# EAGLE design bengkel_elektronika(penghitung otomatis) (EAGLE 7.1.0)
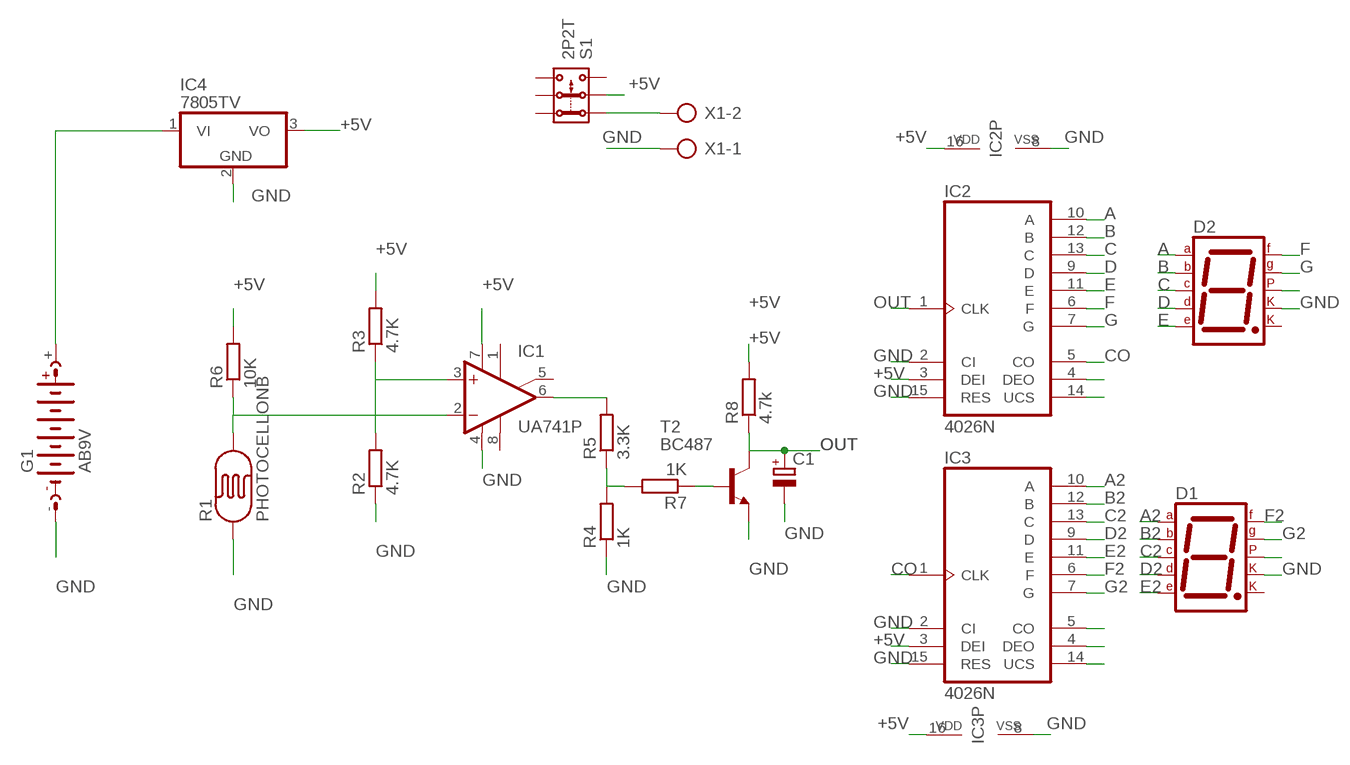
[diagram p0: schematic, sheet 1]

## Parts
C1  CPOL-EUE2-4  [E2-4]
D1  7SEG-CK  [7SEG-13]
D2  7SEG-CK  [7SEG-13]
G1  AB9V  [AB9V]
IC1  UA741P  [DIL08]
IC2  4026N  [DIL16]
IC3  4026N  [DIL16]
IC4  7805TV  [TO220V]
R1  PHOTOCELLONB  [ON_BOARD]
R2  4.7K  R-EU_0207/7  [0207/7]
R3  4.7K  R-EU_0207/7  [0207/7]
R4  1K  R-EU_0207/7  [0207/7]
R5  3.3K  R-EU_0207/7  [0207/7]
R6  10K  R-EU_0207/7  [0207/7]
R7  1K  R-EU_0207/7  [0207/7]
R8  4.7k  R-EU_0207/7  [0207/7]
S1  2P2T  [2P2T]
T2  BC487  [TO92-EBC]
X1  AK500/2  [AK500/2]

## Nets
+5V: IC1.7(V+) IC2.3(DEI) IC2.16(VDD) IC3.3(DEI) IC3.16(VDD) IC4.3(VO) R3.2 R6.2 R8.2 S1.2.1
A: D2.7(A) IC2.10(A)
A2: D1.7(A) IC3.10(A)
B: D2.6(B) IC2.12(B)
B2: D1.6(B) IC3.12(B)
C: D2.4(C) IC2.13(C)
C2: D1.4(C) IC3.13(C)
CO: IC2.5(CO) IC3.1(CLK)
D: D2.2(D) IC2.9(D)
D2: D1.2(D) IC3.9(D)
E: D2.1(E) IC2.11(E)
E2: D1.1(E) IC3.11(E)
F: D2.9(F) IC2.6(F)
F2: D1.9(F) IC3.6(F)
G: D2.10(G) IC2.7(G)
G2: D1.10(G) IC3.7(G)
GND: C1.- D1.3(CK1) D2.3(CK1) G1.- IC1.4(V-) IC2.2(CI) IC2.8(VSS) IC2.15(RES) IC3.2(CI) IC3.8(VSS) IC3.15(RES) IC4.2(GND) R1.1 R2.1 R4.1 T2.E X1.1
N$1: IC1.2(-IN) R1.2 R6.1
N$2: IC1.3(+IN) R2.2 R3.1
N$3: IC1.6(OUT) R5.2
N$4: R4.2 R5.1 R7.2
N$5: R7.1 T2.B
N$6: S1.1.1 X1.2
N$7: G1.+ IC4.1(VI)
N$21: D2.5(DP)
N$24: D1.5(DP)
N$43: IC3.14(UCS)
N$44: IC3.4(DEO)
N$45: IC3.5(CO)
N$47: IC2.4(DEO)
N$48: IC2.14(UCS)
OUT: C1.+ IC2.1(CLK) R8.1 T2.C
Unconnected: D1.8(CK2) D2.8(CK2) IC1.1(ON1) IC1.5(ON2) IC1.8(OPT) S1.1.2 S1.2.2 S1.3.1 S1.3.2

## Library data of the parts
C1 = rcl:CPOL-EU: POLARIZED CAPACITOR, European symbol
D1 D2 = special:7SEG-CK: 7-segment DISPLAY single cathode, 13 mm
G1 = battery:AB9V: 9-V BATTERY CLIP
IC1 = linear:*741: OP AMP
IC2 IC3 = 40xx:4026: Decade COUNTER/DIVIDER, 7-seg. outputs
IC4 = linear:78*: Positive VOLTAGE REGULATOR Source: http://cache.national.com/ds/LM/LM78L05.pdf http://www.fairchildsemi.com/ds/LM/LM7805.pdf
R1 = LDR:PHOTOCELL: Photo Resitor
R2-R8 = rcl:R-EU_: RESISTOR, European symbol
S1 = switch:2P2T: SLIDE SWITCH 2P2T Part No. SS-22F05-G(A)4 Source: CANAL ELECTRONIC CO., LTD .. switsch.pdf
T2 = transistor-npn:BC487*: NPN Transistor
X1 = con-ptr500:AK500/2: CONNECTOR; OC_FARNELL: unknown; OC_NEWARK: unknown

## Board
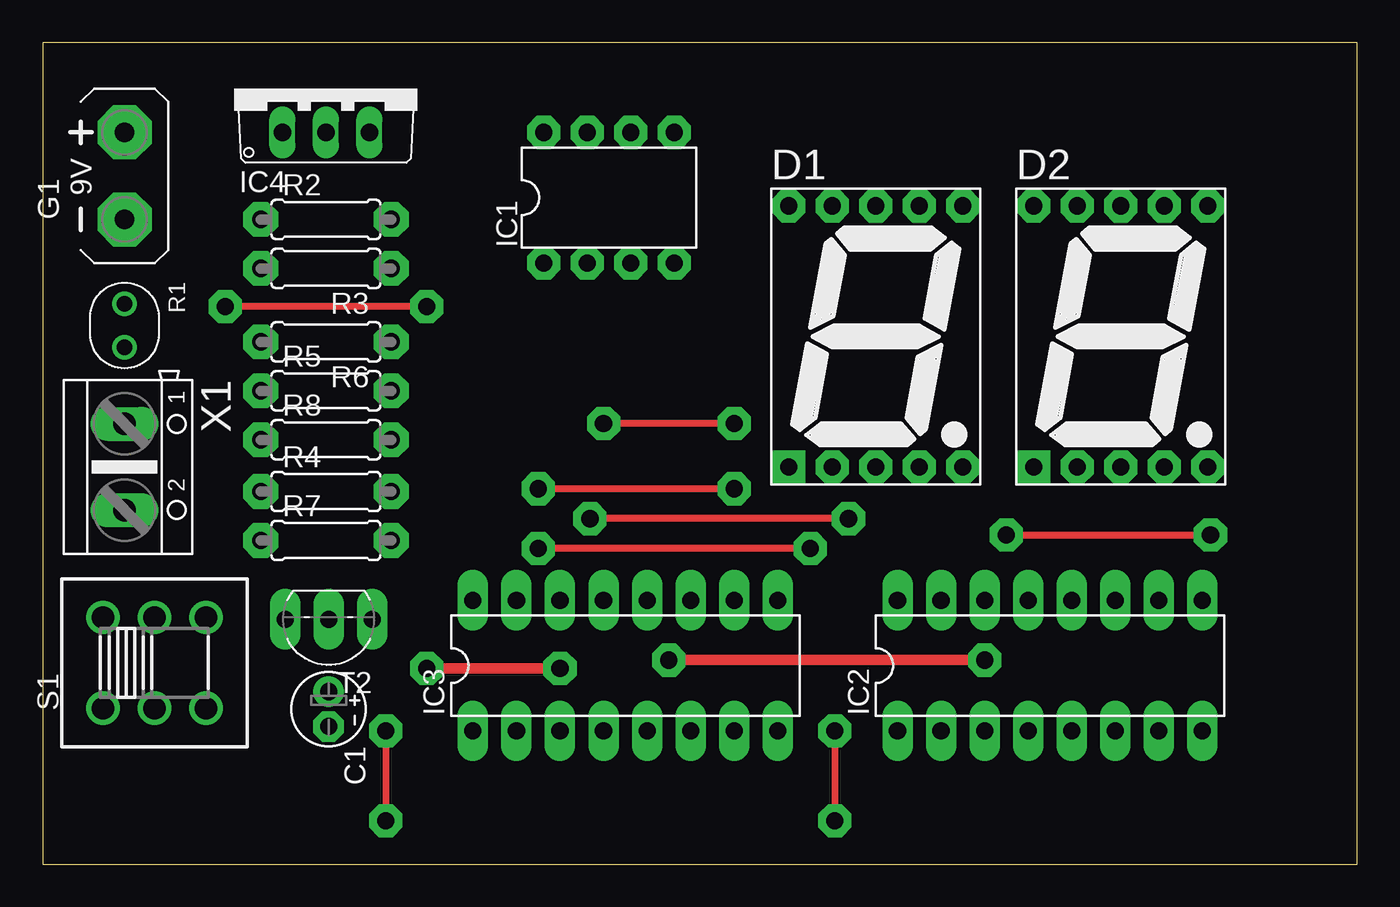
[diagram p1: board, top side]
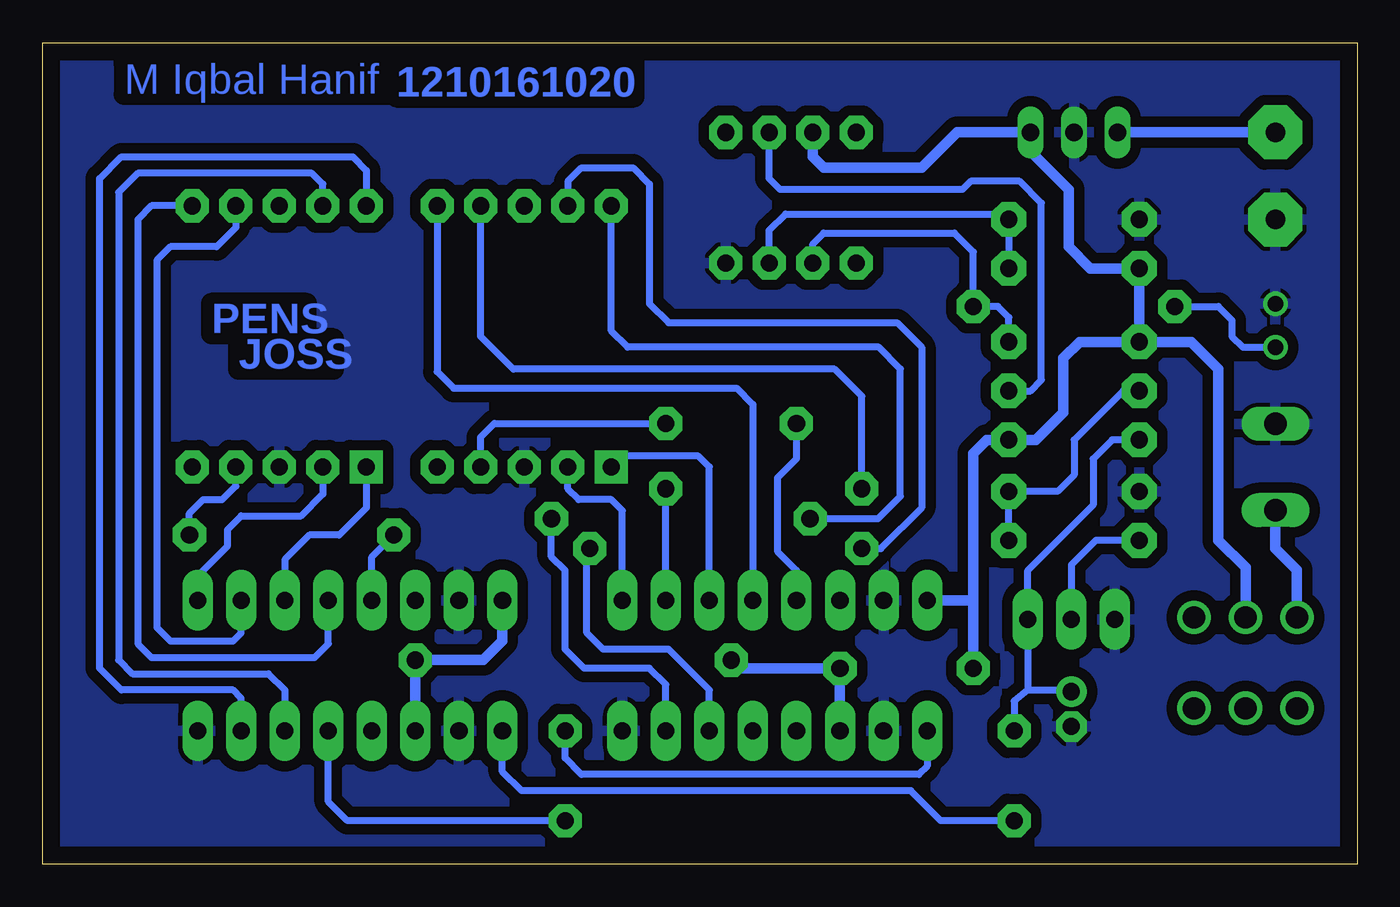
[diagram p2: board, bottom side, seen from below]

Size 76.66 x 47.93 mm. Coordinates in mm from the lower left corner, seen from the top.
Outline: 0,0 76.66,0 76.66,47.93 0,47.93 0,0
Copper layers (1*16): Top 0.035mm / dielectric 1.5mm / Bottom 0.035mm
Design rules "default": minimum track width 10mil, minimum drill 24mil, track to track 8mil, track to pad 8mil, pad to pad 8mil, via to via 8mil, smd to smd 8mil, copper to edge 40mil, drill to drill 8mil, minimum pad ring 10mil, minimum via ring 8mil, stop-mask expansion 4mil, vias tented up to drill 0mil, thermal gap 10mil

### Footprints (pad centres in the part's own frame; a part is rotated, then mirrored left to right if it is on the bottom)
E2-4 = drill 1 pad 1.778: + -1.016,0 | drill 1 pad 1.778 octagon: - 1.016,0
7SEG-13 = drill 1 pad 1.93 square: 1 -5.08,-7.62 | drill 1 pad 1.93 octagon: 2 -2.54,-7.62; 3 0,-7.62; 4 2.54,-7.62; 5 5.08,-7.62; 6 5.08,7.62; 7 2.54,7.62; 8 0,7.62; 9 -2.54,7.62; 10 -5.08,7.62
AB9V = drill 1.118 pad 3.15 octagon: + 0,2.54; - 0,-2.54
DIL08 = drill 1 pad 1.93 octagon: 1 -3.81,-3.81; 2 -1.27,-3.81; 3 1.27,-3.81; 4 3.81,-3.81; 5 3.81,3.81; 6 1.27,3.81; 7 -1.27,3.81; 8 -3.81,3.81
DIL16 = drill 1 pad 1.778 long: 1 -8.89,-3.81; 2 -6.35,-3.81; 3 -3.81,-3.81; 4 -1.27,-3.81; 5 1.27,-3.81; 6 3.81,-3.81; 7 6.35,-3.81; 8 8.89,-3.81; 9 8.89,3.81; 10 6.35,3.81; 11 3.81,3.81; 12 1.27,3.81; 13 -1.27,3.81; 14 -3.81,3.81; 15 -6.35,3.81; 16 -8.89,3.81
TO220V = drill 1.016 long: 1 -2.54,-2.54; 2 0,-2.54; 3 2.54,-2.54
ON_BOARD = drill 0.9: 1 -1.27,0; 2 1.27,0
0207/7 = drill 1 pad 2.032 octagon: 1 -3.81,0; 2 3.81,0
2P2T = drill 1.3 pad 1.93: 1.1 -3,2.65; 1.2 -3,-2.65; 2.1 0,2.65; 2.2 0,-2.65; 3.1 3,2.65; 3.2 3,-2.65
TO92-EBC = drill 1 pad 1.778 long: B 0,-1.27; C -2.54,-1.27; E 2.54,-1.27
AK500/2 = drill 1.321 long: 1 -2.515,0; 2 2.515,0

### Placement (x,y rotation side)
C1  16.67,9.05 270 top
D1  48.58,30.8 0 top
D2  62.86,30.8 0 top
G1  4.76,40.16 0 top
IC1  33.02,38.89 0 top
IC2  58.74,11.59 0 top
IC3  33.97,11.59 0 top
IC4  16.51,45.24 0 top
R1  4.76,31.43 270 top
R2  16.51,37.62 0 top
R3  16.51,34.77 180 top
R4  16.51,21.75 0 top
R5  16.51,27.62 0 top
R6  16.51,30.48 180 top
R7  16.51,18.89 0 top
R8  16.51,24.77 0 top
S1  6.51,11.75 0 top
T2  16.67,13.02 180 top
X1  4.76,23.18 270 top

### Tracks (layer width: path | path; a pad name or v marks a point on that pad's centre or on a via)
+5V  (via drill 1 pad 1.93)
  Top 0.61: v30.16,11.43 v22.38,11.43 | v36.51,11.91 v54.93,11.91
  Bottom 0.61: R6.2 R3.2 15.56,34.77 16.83,36.04 16.83,39.37 19.05,41.59 IC4.3 23.34,42.7 25.4,40.64 31.11,40.64 31.75,41.28 IC1.7 | 22.38,15.4 22.38,23.97 21.59,24.77 R8.2 18.73,24.77 17.14,26.35 17.14,29.53 16.19,30.48 R6.2 | 22.38,15.4 IC3.16 | IC2.3 v54.93,11.91 50.96,11.91 49.85,13.02 IC2.16 | S1.2.1 6.51,17.3 8.1,18.89 8.1,28.89 9.68,30.48 R6.2 | IC3.3 v30.16,11.43 36.04,11.43 v36.51,11.91 | v22.38,11.43 22.38,15.4
A
  Bottom 0.406: D2.7 65.4,37.15 66.52,36.04 69.21,36.04 70.01,35.24 70.01,13.81 69.21,13.02 65.56,13.02 65.09,13.49 IC2.10
A2  (via drill 1 pad 1.93)
  Top 0.406: v40.32,21.91 v28.89,21.91
  Bottom 0.406: IC3.10 v40.32,21.91 | v28.89,21.91 28.89,27.31 30.48,28.89 49.21,28.89 51.12,30.8 D1.7
B
  Bottom 0.406: D2.6 70.33,38.42 71.12,37.62 71.12,12.86 70.33,12.07 60.8,12.07 60.01,12.86 IC2.12
B2
  Bottom 0.406: D1.6 53.66,28.73 52.7,27.78 36.19,27.78 35.24,26.83 IC3.12
C  (via drill 1 pad 1.93)
  Top 0.406: v56.2,19.21 v68.1,19.21
  Bottom 0.406: IC2.13 57.47,17.94 v56.2,19.21 | v68.1,19.21 68.1,20.48 67.31,21.27 66.2,21.27 65.4,22.07 D2.4
C2  (via drill 1 pad 1.93)
  Top 0.406: v40.32,25.72 v32.7,25.72
  Bottom 0.406: v32.7,25.72 32.7,23.65 33.81,22.54 33.81,18.26 32.7,17.15 IC3.13 | D1.4 51.12,24.92 50.32,25.72 v40.32,25.72
CO  (via drill 1 pad 1.93)
  Top 0.406: v46.2,7.78 v46.2,2.54
  Bottom 0.406: IC3.1 25.08,5.72 25.56,5.24 45.24,5.24 46.2,6.19 v46.2,7.78 | v46.2,2.54 58.9,2.54 60.01,3.65 IC2.5
D
  Bottom 0.406: D2.2 60.32,21.59 61.59,20.32 65.09,20.32 65.88,19.53 65.88,18.57 67.63,16.83 IC2.9
D2
  Bottom 0.406: IC3.9 42.86,20.64 43.5,21.27 45.4,21.27 46.04,21.91 D1.2
E
  Bottom 0.406: D2.1 57.78,20.8 59.37,19.21 61.12,19.21 62.55,17.78 IC2.11
E2
  Bottom 0.406: IC3.11 37.78,23.18 38.42,23.81 42.86,23.81 D1.1
F
  Bottom 0.406: D2.9 60.32,39.69 60.96,40.32 71.12,40.32 72.23,39.21 72.23,11.91 71.44,11.11 63.5,11.11 62.55,10.16 IC2.6
F2  (via drill 1 pad 1.93)
  Top 0.406: v44.77,18.42 v28.89,18.42
  Bottom 0.406: IC3.6 37.78,10.16 40.16,12.54 43.97,12.54 44.93,13.49 44.93,18.26 v44.77,18.42 | v28.89,18.42 27.78,18.42 25.4,20.8 25.4,30.16 26.83,31.59 40.16,31.59 41.27,32.7 41.27,39.69 42.23,40.64 45.24,40.64 46.04,39.85 D1.9
G
  Bottom 0.406: IC2.7 65.09,9.68 65.56,10.16 72.07,10.16 73.34,11.43 73.34,40.01 72.07,41.28 58.58,41.28 57.78,40.48 D2.10
G2  (via drill 1 pad 1.93)
  Top 0.406: v46.99,20.16 v31.91,20.16
  Bottom 0.406: IC3.7 40.32,10.48 41.27,11.43 45.08,11.43 46.2,12.54 46.2,17.15 46.99,17.94 v46.99,20.16 | v31.91,20.16 27.94,20.16 26.64,21.46 26.64,28.9 27.9,30.16 42.54,30.16 43.5,31.12 D1.10
GND
  pour Bottom (isolate 0.61): 0.16,0 76.52,0 76.52,47.78 0.16,47.62
N$1  (via drill 1 pad 1.93)
  Top 0.406: v22.38,32.54 v10.64,32.54
  Bottom 0.406: R6.1 20.32,31.91 20.95,32.54 v22.38,32.54 22.38,35.72 23.49,36.83 31.11,36.83 31.75,36.2 IC1.2 | v10.64,32.54 8.1,32.54 7.3,31.75 7.3,30.8 6.67,30.16 R1.2
N$2
  Bottom 0.406: R3.1 R2.2 20.64,37.94 33.34,37.94 34.29,36.99 IC1.3
N$3
  Bottom 0.406: R5.2 19.05,27.62 18.41,28.26 18.41,38.58 19.68,39.85 22.54,39.85 23.02,39.37 33.65,39.37 34.29,40.01 IC1.6
N$4
  Bottom 0.406: R7.2 R4.2 17.46,21.75 16.51,22.7 16.51,24.77 13.65,27.62 R5.1
N$5
  Bottom 0.406: R7.1 15.24,18.89 16.67,17.46 T2.B
N$6
  Bottom 0.61: S1.1.1 3.51,17.16 4.76,18.42 X1.2
N$7
  Bottom 0.61: G1.+ IC4.1
OUT  (via drill 1 pad 1.93)
  Top 0.406: v20,7.78 v20,2.54
  Bottom 0.406: R8.1 14.29,24.77 15.4,23.65 15.4,20.96 19.21,17.15 T2.C 19.21,10.16 | 19.21,10.16 16.76,10.16 C1.+ | 19.21,10.16 20,9.53 v20,7.78 | v20,2.54 24.29,2.54 26.03,4.29 48.74,4.29 49.85,5.4 IC2.1

### Text on the board
Bottom: 1210161020 | M Iqbal Hanif | PENS | JOSS